# Altium schematic sheet kalibracija.SchDoc
size A4
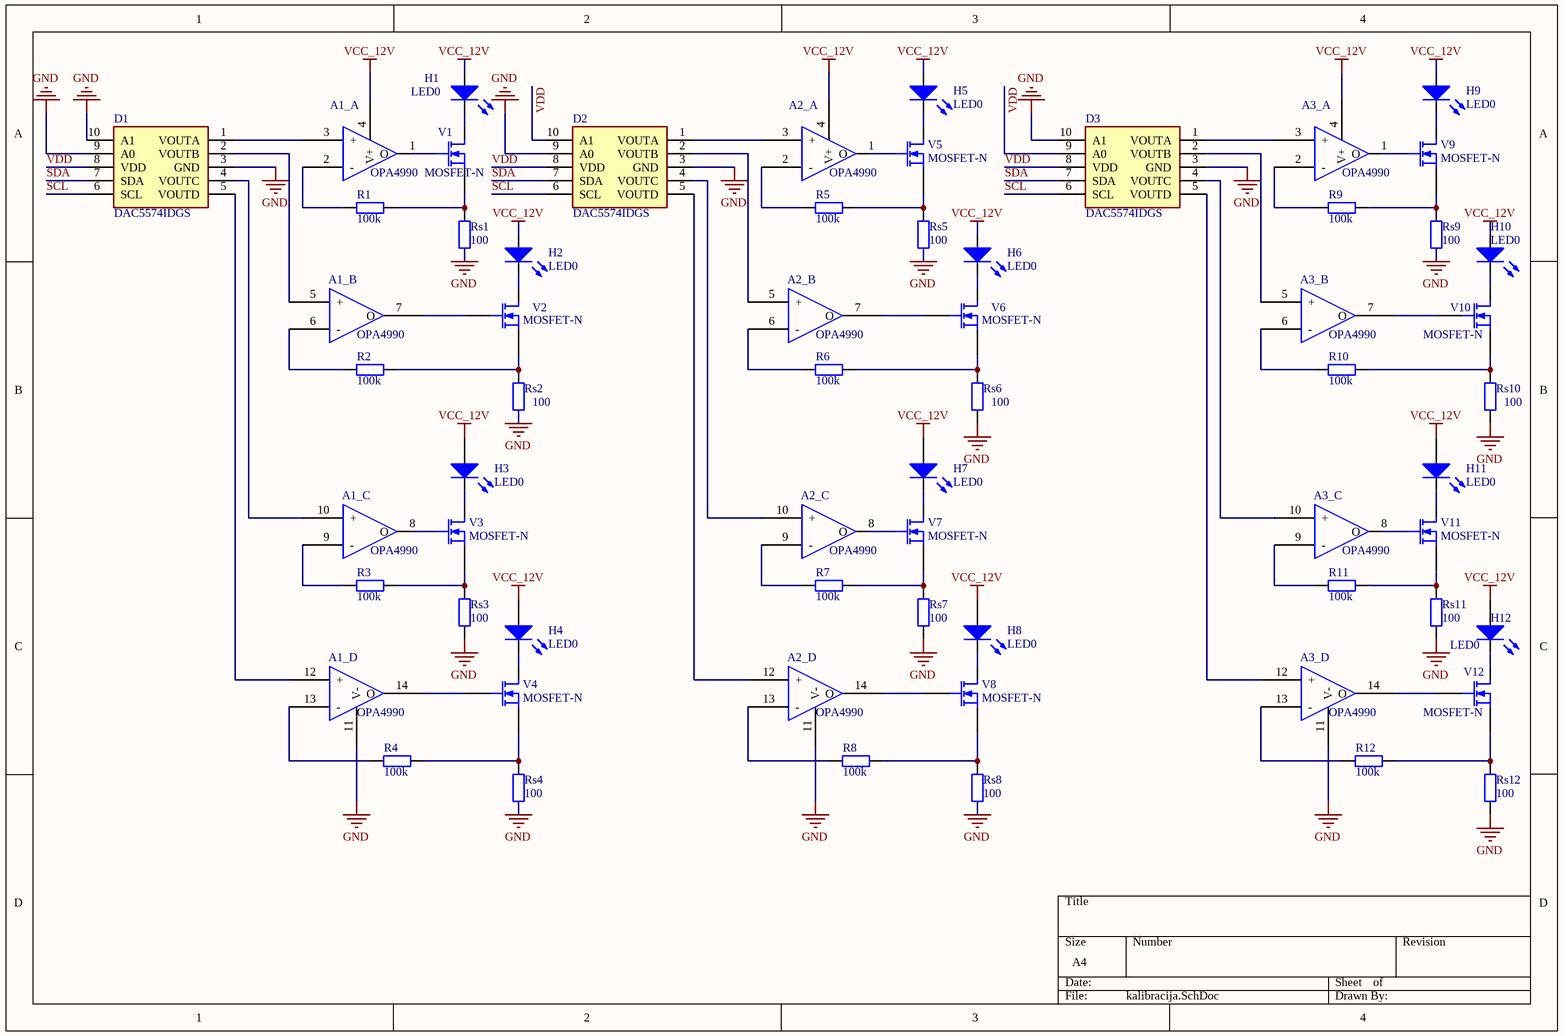
[diagram p0: kalibracija.SchDoc]

## Parts
A1_  OPA4990  [SOIC127P600X175-14N]  (parts A,B,C,D of 4)
A2_  OPA4990  [SOIC127P600X175-14N]  (parts A,B,C,D of 4)
A3_  OPA4990  [SOIC127P600X175-14N]  (parts A,B,C,D of 4)
D1  DAC5574IDGS  [SOP50P490X110-10N]
D2  DAC5574IDGS  [SOP50P490X110-10N]
D3  DAC5574IDGS  [SOP50P490X110-10N]
H1  LED0  [HDR1X2]
H2  LED0  [HDR1X2]
H3  LED0  [HDR1X2]
H4  LED0  [HDR1X2]
H5  LED0  [HDR1X2]
H6  LED0  [HDR1X2]
H7  LED0  [HDR1X2]
H8  LED0  [HDR1X2]
H9  LED0  [HDR1X2]
H10  LED0  [HDR1X2]
H11  LED0  [HDR1X2]
H12  LED0  [HDR1X2]
R1  100k  [AXIAL-0.4]
R2  100k  [AXIAL-0.4]
R3  100k  [AXIAL-0.4]
R4  100k  [AXIAL-0.4]
R5  100k  [AXIAL-0.4]
R6  100k  [AXIAL-0.4]
R7  100k  [AXIAL-0.4]
R8  100k  [AXIAL-0.4]
R9  100k  [AXIAL-0.4]
R10  100k  [AXIAL-0.4]
R11  100k  [AXIAL-0.4]
R12  100k  [AXIAL-0.4]
Rs1  100  [AXIAL-0.4]
Rs2  100  [AXIAL-0.4]
Rs3  100  [AXIAL-0.4]
Rs4  100  [AXIAL-0.4]
Rs5  100  [AXIAL-0.4]
Rs6  100  [AXIAL-0.4]
Rs7  100  [AXIAL-0.4]
Rs8  100  [AXIAL-0.4]
Rs9  100  [AXIAL-0.4]
Rs10  100  [AXIAL-0.4]
Rs11  100  [AXIAL-0.4]
Rs12  100  [AXIAL-0.4]
V1  MOSFET-N  [TO-92]
V2  MOSFET-N  [TO-92]
V3  MOSFET-N  [TO-92]
V4  MOSFET-N  [TO-92]
V5  MOSFET-N  [TO-92]
V6  MOSFET-N  [TO-92]
V7  MOSFET-N  [TO-92]
V8  MOSFET-N  [TO-92]
V9  MOSFET-N  [TO-92]
V10  MOSFET-N  [TO-92]
V11  MOSFET-N  [TO-92]
V12  MOSFET-N  [TO-92]

## Nets
GND: A1_.11(V-) A2_.11(V-) A3_.11(V-) D1.3(GND) D1.9(A0) D1.10(A1) D2.3(GND) D2.9(A0) D3.3(GND) D3.10(A1) Rs1.1 Rs2.1 Rs3.1 Rs4.1 Rs5.1 Rs6.1 Rs7.1 Rs8.1 Rs9.1 Rs10.1 Rs11.1 Rs12.1
VCC_12V: A1_.4(V+) A2_.4(V+) A3_.4(V+) H1.1(A) H2.1(A) H3.1(A) H4.1(A) H5.1(A) H6.1(A) H7.1(A) H8.1(A) H9.1(A) H10.1(A) H11.1(A) H12.1(A)
SCL: D1.6(SCL) D2.6(SCL) D3.6(SCL)
SDA: D1.7(SDA) D2.7(SDA) D3.7(SDA)
VDD: D1.8(VDD) D2.8(VDD) D2.10(A1) D3.8(VDD) D3.9(A0)
NetA1__1: A1_.1(O) V1.2(G)
NetA1__2: A1_.2(-) R1.1
NetA1__3: A1_.3(+) D1.1(VOUTA)
NetA1__5: A1_.5(+) D1.2(VOUTB)
NetA1__6: A1_.6(-) R2.1
NetA1__7: A1_.7(O) V2.2(G)
NetA1__8: A1_.8(O) V3.2(G)
NetA1__9: A1_.9(-) R3.1
NetA1__10: A1_.10(+) D1.4(VOUTC)
NetA1__12: A1_.12(+) D1.5(VOUTD)
NetA1__13: A1_.13(-) R4.1
NetA1__14: A1_.14(O) V4.2(G)
NetA2__1: A2_.1(O) V5.2(G)
NetA2__2: A2_.2(-) R5.1
NetA2__3: A2_.3(+) D2.1(VOUTA)
NetA2__5: A2_.5(+) D2.2(VOUTB)
NetA2__6: A2_.6(-) R6.1
NetA2__7: A2_.7(O) V6.2(G)
NetA2__8: A2_.8(O) V7.2(G)
NetA2__9: A2_.9(-) R7.1
NetA2__10: A2_.10(+) D2.4(VOUTC)
NetA2__12: A2_.12(+) D2.5(VOUTD)
NetA2__13: A2_.13(-) R8.1
NetA2__14: A2_.14(O) V8.2(G)
NetA3__1: A3_.1(O) V9.2(G)
NetA3__2: A3_.2(-) R9.1
NetA3__3: A3_.3(+) D3.1(VOUTA)
NetA3__5: A3_.5(+) D3.2(VOUTB)
NetA3__6: A3_.6(-) R10.1
NetA3__7: A3_.7(O) V10.2(G)
NetA3__8: A3_.8(O) V11.2(G)
NetA3__9: A3_.9(-) R11.1
NetA3__10: A3_.10(+) D3.4(VOUTC)
NetA3__12: A3_.12(+) D3.5(VOUTD)
NetA3__13: A3_.13(-) R12.1
NetA3__14: A3_.14(O) V12.2(G)
NetH1_2: H1.2(K) V1.1(D)
NetH2_2: H2.2(K) V2.1(D)
NetH3_2: H3.2(K) V3.1(D)
NetH4_2: H4.2(K) V4.1(D)
NetH5_2: H5.2(K) V5.1(D)
NetH6_2: H6.2(K) V6.1(D)
NetH7_2: H7.2(K) V7.1(D)
NetH8_2: H8.2(K) V8.1(D)
NetH9_2: H9.2(K) V9.1(D)
NetH10_2: H10.2(K) V10.1(D)
NetH11_2: H11.2(K) V11.1(D)
NetH12_2: H12.2(K) V12.1(D)
NetR1_2: R1.2 Rs1.2 V1.3(S)
NetR2_2: R2.2 Rs2.2 V2.3(S)
NetR3_2: R3.2 Rs3.2 V3.3(S)
NetR4_2: R4.2 Rs4.2 V4.3(S)
NetR5_2: R5.2 Rs5.2 V5.3(S)
NetR6_2: R6.2 Rs6.2 V6.3(S)
NetR7_2: R7.2 Rs7.2 V7.3(S)
NetR8_2: R8.2 Rs8.2 V8.3(S)
NetR9_2: R9.2 Rs9.2 V9.3(S)
NetR10_2: R10.2 Rs10.2 V10.3(S)
NetR11_2: R11.2 Rs11.2 V11.3(S)
NetR12_2: R12.2 Rs12.2 V12.3(S)

## Library data of the parts
D1-D3 = DAC5574IDGS: Integrated Circuit; Manufacturer_Name: Texas Instruments; Datasheet Link: http://www.ti.com/lit/gpn/dac5574; Height: 1.1mm; Manufacturer_Part_Number: DAC5574IDGS; Mouser Part Number: 595-DAC5574IDGS; Mouser Price/Stock: https://www.mouser.com/Search/Refine.aspx?Keyword=595-DAC5574IDGS; RS Part Number: 6621533P; RS Price/Stock: http://uk.rs-online.com/web/p/products/6621533P
H1-H12 = LED0: Typical INFRARED GaAs LED; Published: 8-Jun-2000; LatestRevisionDate: 08-Jul-2005; LatestRevisionNote: Mech Layer 1 removed.; PackageReference: LED-0; Publisher: Altium Limited; PackageDescription: LED; 2 Leads
R1-R12 Rs1-Rs12 = Res2: Resistor; Value: 1K; Published: 8-Jun-2000; LatestRevisionDate: 17-Jul-2002; LatestRevisionNote: Re-released for DXP Platform.; PackageReference: AXIAL-0.4; Publisher: Altium Limited; PackageDescription: Axial Device, Thru-Hole; 2 Leads; 0.4 in Pin Spacing
V1-V12 = MOSFET-N: N-Channel MOSFET; Published: 8-Jun-2000; LatestRevisionDate: 17-Jul-2002; LatestRevisionNote: Re-released for DXP Platform.; PackageVersion: 1995/1996; PackageReference: E3; Publisher: Altium Limited; PackageDescription: TO, Flat Index; 3 In-Line, Axial Leads; Body Dia. 4.6mm; Lead Dia. 0.5 mm (max)